# EAGLE design m80-v0.01 (EAGLE 9.6.2)
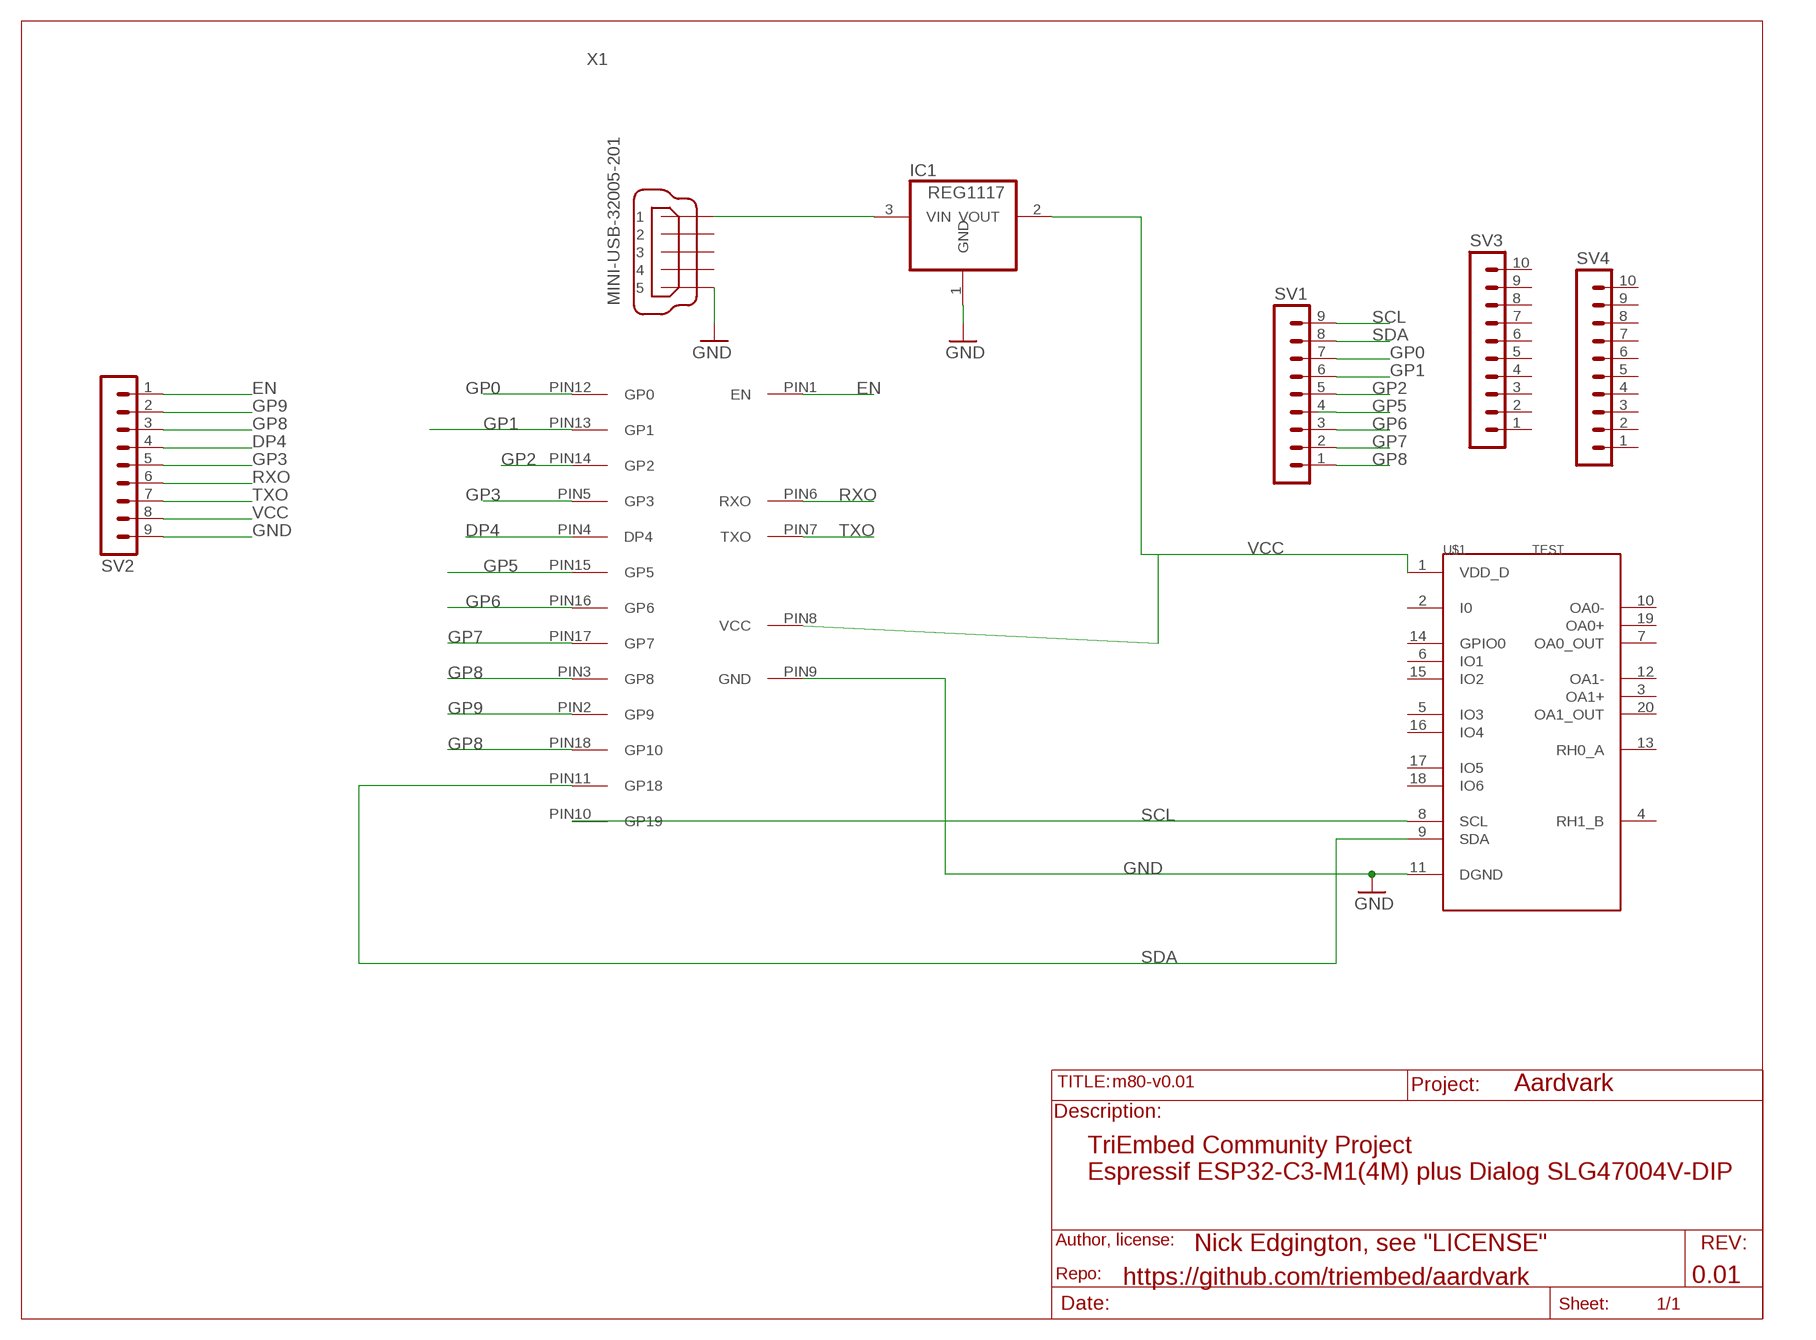
[diagram p0: schematic, sheet 1]

## Parts
IC1  REG1117  [SOT223]
SV1  MA09-1  [MA09-1]
SV2  MA09-1  [MA09-1]
SV3  MA10-1  [MA10-1]
SV4  MA10-1  [MA10-1]
U$1  TEST  [3M_220-3342-00-0602J_0]
U$2  ESP32C3  [ESP32-C3-01M]
X1  MINI-USB-32005-201  [32005-201]

## Nets
DP4: SV2.4 U$2.PIN4(DP4)
EN: SV2.1 U$2.PIN1(EN)
GND: IC1.1(GND) SV2.9 U$1.11(DGND) U$2.PIN9(GND) X1.5
GP0: SV1.7 U$2.PIN12(GP0)
GP1: SV1.6 U$2.PIN13(GP1)
GP2: SV1.5 U$2.PIN14(GP2)
GP3: SV2.5 U$2.PIN5(GP3)
GP5: SV1.4 U$2.PIN15(GP5)
GP6: SV1.3 U$2.PIN16(GP6)
GP7: SV1.2 U$2.PIN17(GP7)
GP8: SV1.1 SV2.3 U$2.PIN3(GP8) U$2.PIN18(GP10)
GP9: SV2.2 U$2.PIN2(GP9)
N$1: IC1.3(VIN) X1.1
RXO: SV2.6 U$2.PIN6(RXO)
SCL: SV1.9 U$1.8(SCL) U$2.PIN10(GP19)
SDA: SV1.8 U$1.9(SDA) U$2.PIN11(GP18)
TXO: SV2.7 U$2.PIN7(TXO)
VCC: IC1.2(VOUT) SV2.8 U$1.1(VDD_D) U$2.PIN8(VCC)
Unconnected: SV3.1 SV3.2 SV3.3 SV3.4 SV3.5 SV3.6 SV3.7 SV3.8 SV3.9 SV3.10 SV4.1 SV4.2 SV4.3 SV4.4 SV4.5 SV4.6 SV4.7 SV4.8 SV4.9 SV4.10 U$1.2(I0) U$1.3(OA1+) U$1.4(RH1_B) U$1.5(IO3) U$1.6(IO1) U$1.7(OA0_OUT) U$1.10(OA0-) U$1.12(OA1-) U$1.13(RH0_A) U$1.14(GPIO0) U$1.15(IO2) U$1.16(IO4) U$1.17(IO5) U$1.18(IO6) U$1.19(OA0+) U$1.20(OA1_OUT) X1.2 X1.3 X1.4

## Notes on the sheet
- Aardvark
- TriEmbed Community Project
  Espressif ESP32-C3-M1(4M) plus Dialog SLG47004V-DIP
- Nick Edgington, see "LICENSE"
- https://github.com/triembed/aardvark | 0.01

## Library data of the parts
IC1 = burr-brown:REG1117: 800mA and 1A Low Dropout (LDO) Positive Regulator 1.8V, 2.5V, 2.85V, 3.3V, 5V, and Adj; MPN: REG1117; OC_FARNELL: 1097566; OC_NEWARK: 14P6981
SV1 SV2 = con-lstb:MA09-1: PIN HEADER; OC_FARNELL: unknown; OC_NEWARK: unknown
SV3 SV4 = con-lstb:MA10-1: PIN HEADER; OC_FARNELL: unknown; OC_NEWARK: unknown
U$1 = test:TEST
U$2 = untitled:ESP32C3
X1 = con-cypressindustries:MINI-USB-: MINI USB-B Conector Source: www.cypressindustries.com; OC_FARNELL: unknown; OC_NEWARK: unknown

## Board
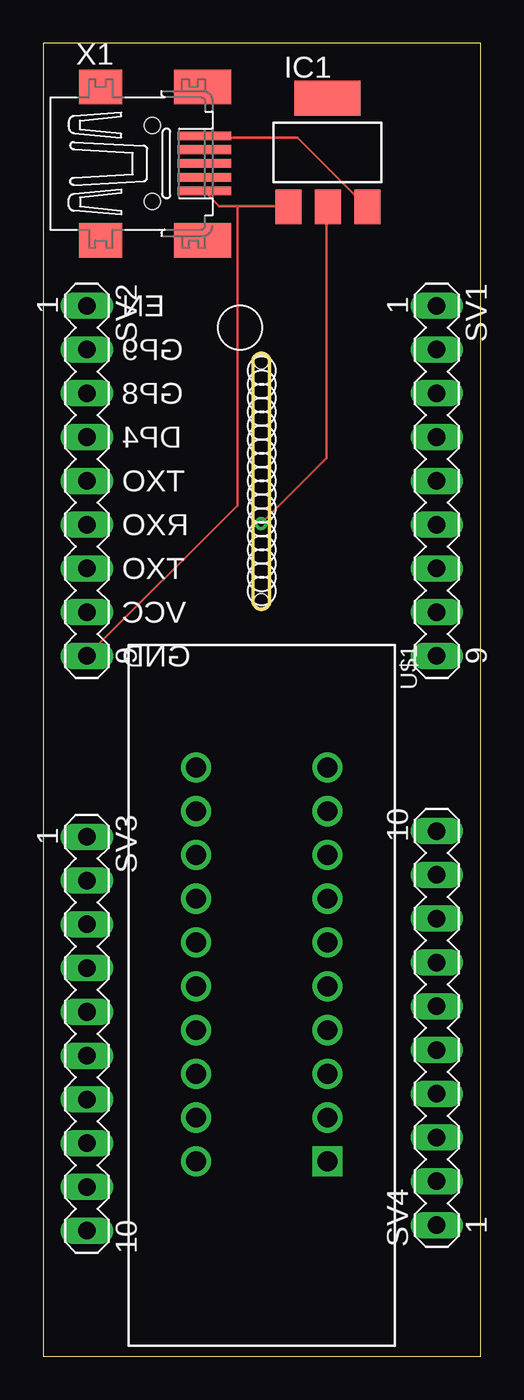
[diagram p1: board, top side]
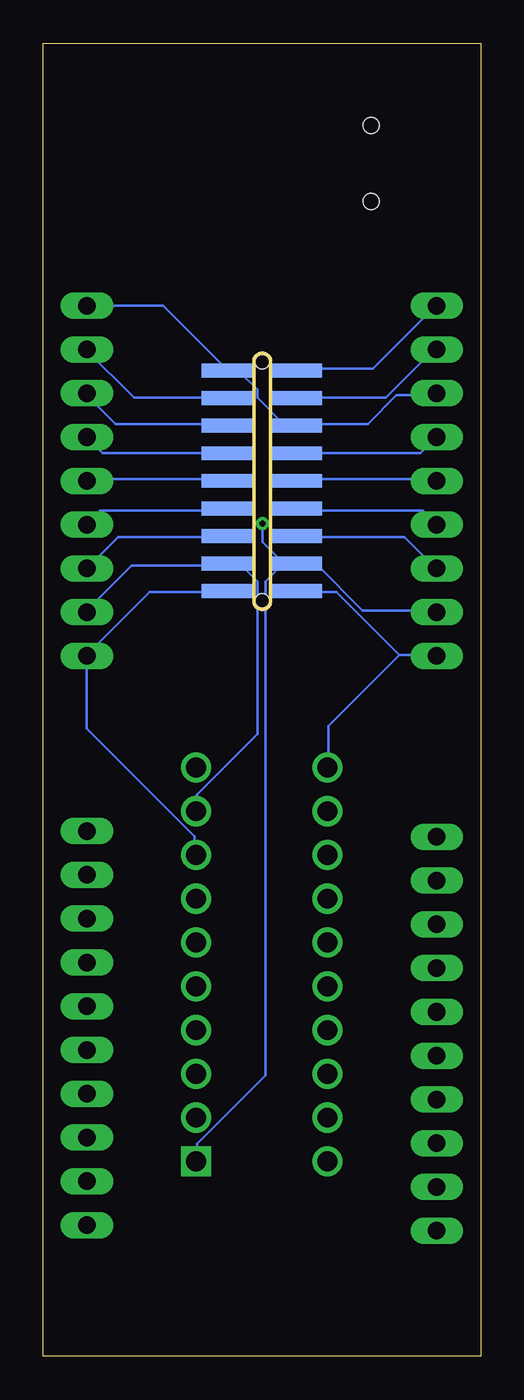
[diagram p2: board, bottom side, seen from below]

Size 25.4 x 76.2 mm. Coordinates in mm from the lower left corner, seen from the top.
Outline: 0,0 25.4,0 25.4,76.2 0,76.2 0,0
Copper layers (1*16): Top 0.035mm / dielectric 1.5mm / Bottom 0.035mm
Design rules "default": minimum track width 6mil, minimum drill 0.35mm, track to track 6mil, track to pad 6mil, pad to pad 6mil, via to via 6mil, smd to smd 6mil, copper to edge 40mil, drill to drill 6mil, minimum pad ring 10mil, minimum via ring 8mil, stop-mask expansion 4mil, vias tented up to drill 0mil, thermal gap 10mil
Holes 0.8 mm at 12.68,43.85 12.68,57.7
Milling: 4 lines

### Footprints (pad centres in the part's own frame; a part is rotated, then mirrored left to right if it is on the bottom)
SOT223 = smd 1.499 x 2.007: 1 -2.261,-3.15; 2 0.025,-3.15; 3 2.311,-3.15 | smd 3.81 x 2.007: 4 0,3.15
MA09-1 = drill 1.016 long: 1 -10.16,0; 2 -7.62,0; 3 -5.08,0; 4 -2.54,0; 5 0,0; 6 2.54,0; 7 5.08,0; 8 7.62,0; 9 10.16,0
MA10-1 = drill 1.016 long: 1 -11.43,0; 2 -8.89,0; 3 -6.35,0; 4 -3.81,0; 5 -1.27,0; 6 1.27,0; 7 3.81,0; 8 6.35,0; 9 8.89,0; 10 11.43,0
3M_220-3342-00-0602J_0 = drill 1.15 pad 1.75 square: 1 9.64,3.81 | drill 1.15 pad 1.75: 2 7.1,3.81; 3 4.56,3.81; 4 2.02,3.81; 5 -0.52,3.81; 6 -3.06,3.81; 7 -5.6,3.81; 8 -8.14,3.81; 9 -10.68,3.81; 10 -13.22,3.81; 11 -13.22,-3.81; 12 -10.68,-3.81; 13 -8.14,-3.81; 14 -5.6,-3.81; 15 -3.06,-3.81; 16 -0.52,-3.81; 17 2.02,-3.81; 18 4.56,-3.81; 19 7.1,-3.81; 20 9.64,-3.81
ESP32-C3-01M = smd 0.8 x 3 bottom: PIN1 -6.4,-2; PIN2 -4.8,-2; PIN3 -3.2,-2; PIN4 -1.6,-2; PIN5 0,-2; PIN6 1.6,-2; PIN7 3.2,-2; PIN8 4.8,-2; PIN9 6.4,-2; PIN10 6.4,2; PIN11 4.8,2; PIN12 3.2,2; PIN13 1.6,2; PIN14 0,2; PIN15 -1.6,2; PIN16 -3.2,2; PIN17 -4.8,2; PIN18 -6.4,2
32005-201 = smd 3.1 x 0.5: 1 3,1.6; 2 3,0.8; 3 3,0; 4 3,-0.8; 5 3,-1.6 | smd 2.5 x 2: M1 -3,-4.45; M2 -3,4.45 | smd 3.3 x 2: M3 2.9,4.45; M4 2.9,-4.45 | hole 0.9: 0,2.2; 0,-2.2

### Placement (x,y rotation side)
IC1  16.51,69.85 0 top
SV1  22.86,50.8 270 top
SV2  2.54,50.8 270 top
SV3  2.54,18.72 270 top
SV4  22.86,19.05 90 top
U$1  12.7,20.95 270 top
U$2  12.7,50.8 270 top
X1  6.35,69.22 0 top

### Tracks (layer width: path | path; a pad name or v marks a point on that pad's centre or on a via)
DP4
  Bottom 0.152: U$2.PIN4 10.67,52.43 3.5,52.43 2.59,53.34 SV2.4
EN
  Bottom 0.152: U$2.PIN1 10.67,57.3 6.25,57.3 2.59,60.96 SV2.1
GND
  Top 0.152: 11.28,66.75 10.21,66.75 9.45,67.51 X1.5 | 11.28,66.75 14.17,66.75 IC1.1 | 11.28,66.75 11.28,49.38 SV2.9
  Bottom 0.152: 4.72,40.69 8.38,44.35 10.67,44.35 U$2.PIN9 | 4.72,40.69 2.59,40.69 SV2.9 | 4.72,40.69 8.84,36.58 8.84,34.29 U$1.11
GP0
  Bottom 0.152: SV1.7 21.03,47.55 14.78,47.55 U$2.PIN12
GP1
  Bottom 0.152: U$2.PIN13 14.78,49.07 22.1,49.07 22.86,48.31 SV1.6
GP2
  Bottom 0.152: U$2.PIN14 14.78,50.9 22.86,50.9 SV1.5
GP3
  Bottom 0.152: U$2.PIN5 10.67,50.9 2.59,50.9 SV2.5
GP5
  Bottom 0.152: SV1.4 21.95,52.43 14.78,52.43 U$2.PIN15
GP6
  Bottom 0.152: U$2.PIN16 14.78,54.1 21.18,54.1 22.86,55.78 SV1.3
GP7
  Bottom 0.152: U$2.PIN17 14.78,55.63 20.12,55.63 22.86,58.37 SV1.2
GP8
  Bottom 0.152: SV2.3 2.59,55.78 4.88,55.78 6.55,54.1 10.67,54.1 U$2.PIN3 10.82,54.1 11.43,54.1 12.95,55.63 12.95,56.08 14.02,57.15 14.63,57.15 U$2.PIN18 14.78,57.3 18.44,60.96 SV1.1
GP9
  Bottom 0.152: U$2.PIN2 10.67,55.63 5.49,55.63 2.59,58.52 SV2.2
N$1
  Top 0.152: IC1.3 18.75,66.75 14.78,70.71 9.45,70.71 X1.1
RXO
  Bottom 0.152: SV2.6 3.35,49.07 10.67,49.07 U$2.PIN6
SCL
  Bottom 0.152: U$2.PIN10 14.78,44.35 19.2,44.35 22.86,40.69 SV1.9 22.86,36.42 16.61,30.18 16.61,29.11 U$1.8
SDA
  Bottom 0.152: SV1.8 22.86,43.28 20.27,45.87 14.78,45.87 U$2.PIN11 14.63,45.87 13.87,45.87 12.95,44.96 12.95,36.12 16.46,32.61 16.46,31.7 U$1.9
TXO
  Bottom 0.152: U$2.PIN7 10.67,47.55 4.42,47.55 2.59,45.72 SV2.7
VCC  (via drill 0.35)
  Top 0.152: v12.65,48.31 16.46,52.12 16.46,66.6 IC1.2
  Bottom 0.152: v12.65,48.31 12.65,47.24 11.43,46.02 | 11.43,46.02 10.82,46.02 U$2.PIN8 | SV2.8 2.59,43.28 6.86,43.28 9.45,45.87 10.67,45.87 U$2.PIN8 | 11.43,46.02 12.5,44.96 12.5,16.31 16.46,12.34 16.46,11.43 U$1.1 | 11.43,46.02 U$2.PIN8

### Text on the board
tNames: EN | GP9 | GP8 | DP4 | TXO | RXO | TXO | VCC | GND